# Altium schematic sheet FLYBACK.SchDoc
size A; SheetNumber: 2; SheetTotal: 21
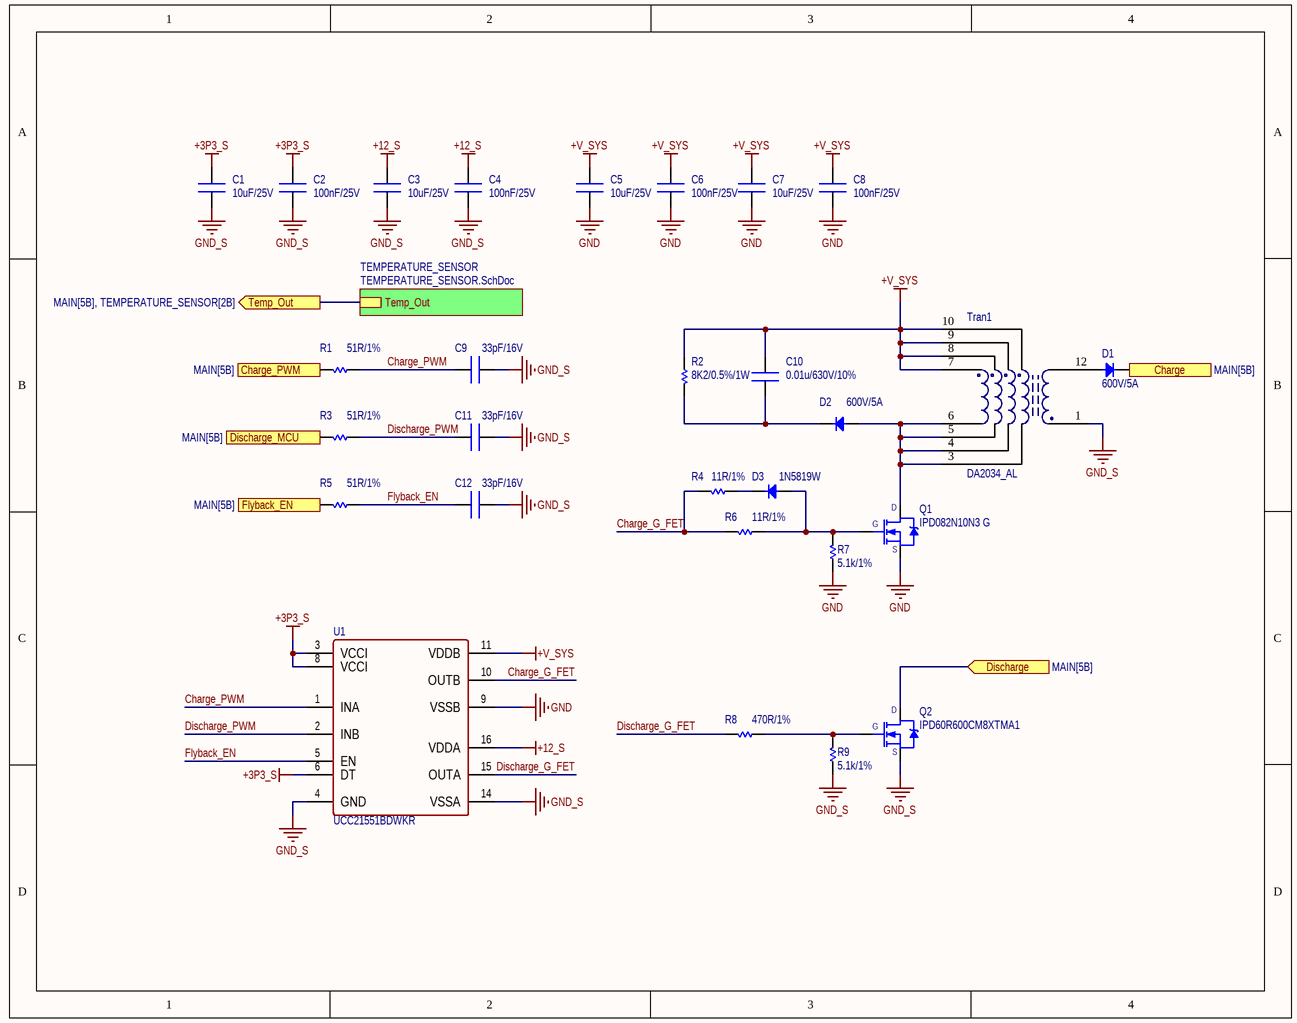
[diagram p0: FLYBACK.SchDoc]

## Parts
C1  10uF/25V  [CN-SMD-0603]
C2  100nF/25V  [CN-SMD-0603]
C3  10uF/25V  [CN-SMD-0603]
C4  100nF/25V  [CN-SMD-0603]
C5  10uF/25V  [CN-SMD-0603]
C6  100nF/25V  [CN-SMD-0603]
C7  10uF/25V  [CN-SMD-0603]
C8  100nF/25V  [CN-SMD-0603]
C9  33pF/16V  [CN-SMD-0603]
C10  0.01u/630V/10%  [CN-SMD-1206]
C11  33pF/16V  [CN-SMD-0603]
C12  33pF/16V  [CN-SMD-0603]
D1  600V/5A  [DIO-SMD-C]
D2  600V/5A  [DIO-SMD-C]
D3  1N5819W  [DIO-SMD-123]
Q1  IPD082N10N3 G  [TO252-123]
Q2  IPD60R600CM8XTMA1  [TO252-123]
R1  51R/1%  [RES-SMD-0603]
R2  8K2/0.5%/1W  [RES-SMD-1206]
R3  51R/1%  [RES-SMD-0603]
R4  11R/1%  [RES-SMD-1206]
R5  51R/1%  [RES-SMD-0603]
R6  11R/1%  [RES-SMD-1206]
R7  5.1k/1%  [RES-SMD-0603]
R8  470R/1%  [RES-SMD-0603]
R9  5.1k/1%  [RES-SMD-0603]
Tran1  DA2034_AL  [DA2034_AL]
U1  UCC21551BDWKR  [UCC21551BDWKR]

## Sub-sheets
TEMPERATURE_SENSOR = TEMPERATURE_SENSOR.SchDoc: Temp_Out

## Ports
Charge (out, see MAIN[5B]), Charge_PWM (in, see MAIN[5B]), Discharge (in, see MAIN[5B]), Discharge_MCU (in, see MAIN[5B]), Flyback_EN (in, see MAIN[5B]), Temp_Out (out, see MAIN[5B], TEMPERATURE_SENSOR[2B])

## Nets
+3P3_S: C1.2 C2.2 U1.3(VCCI) U1.6(DT) U1.8(VCCI)
+12_S: C3.2 C4.2 U1.16(VDDA)
+V_SYS: C5.2 C6.2 C7.2 C8.2 C10.2 R2.1 Tran1.7 Tran1.8 Tran1.9 Tran1.10 U1.11(VDDB)
GND: C5.1 C6.1 C7.1 C8.1 Q1.3(S) R7.1 U1.9(VSSB)
GND_S: C1.1 C2.1 C3.1 C4.1 C9.1 C11.1 C12.1 Q2.3(S) R9.1 Tran1.1 U1.4(GND) U1.14(VSSA)
Charge: D1.2(K) ; port Charge
Charge_G_FET: R4.2 R6.2 U1.10(OUTB)
Charge_PWM: C9.2 R1.1 U1.1(INA)
Charge_PWM: R1.2 ; port Charge_PWM  [a separate net that carries the same name]
Discharge: Q2.2(D) ; port Discharge
Discharge_G_FET: R8.2 U1.15(OUTA)
Discharge_MCU: R3.2 ; port Discharge_MCU
Discharge_PWM: C11.2 R3.1 U1.2(INB)
Flyback_EN: C12.2 R5.1 U1.5(EN)
Flyback_EN: R5.2 ; port Flyback_EN  [a separate net that carries the same name]
Temp_Out: port Temp_Out, sheet TEMPERATURE_SENSOR/Temp_Out
NetC10_1: C10.1 D2.2(K) R2.2
NetD1_1: D1.1(A) Tran1.12
NetD2_1: D2.1(A) Q1.2(D) Tran1.3 Tran1.4 Tran1.5 Tran1.6
NetD3_1: D3.1(A) Q1.1(G) R6.1 R7.2
NetD3_2: D3.2(K) R4.1
NetQ2_1: Q2.1(G) R8.1 R9.2

## Library data of the parts
C1 C3 C5 C7 = CN: 0603W106M250XD; PN: 0603W106M250XD
C2 C4 C6 C8 = CN: CL10B104KA8NNNC; PN: CL10B104KA8NNNC
C9 C11 C12 = CN: C0603C330K4RAC7867; PN: C0603C330K4RAC7867
C10 = CN: CL31B103KHFNFNE; Value: 33pF; PN: CL31B103KHFNFNE
D1 D2 = Diode SMD: VS-5ECU06-M3/9AT; Code - JEDEC: DO-214-AB; Published: 8-Jun-2000; Revision: July-2002: Re-released for DXP Platform.; Publisher: Altium Limited; PN: VS-5ECU06-M3/9AT
D3 = Diode SMD: Default Diode; Code - JEDEC: DO-214-AB; Published: 8-Jun-2000; Revision: July-2002: Re-released for DXP Platform.; Publisher: Altium Limited; PN: 1N5819W
Q1 Q2 = FDD8870
  Q1: PN: IPD082N10N3 G
  Q2: PN: IPD60R600CM8XTMA1
R1 R3 R5 = Res-SMD: ERJ-3EKF51R0V; Manufacturer: Generic Components; Class: Passive; PN: ERJ-3EKF51R0V; Publisher: Altium Hobart Technology Centre
R2 = Res-SMD: HRG3216P-8201-D-T1; Manufacturer: Generic Components; Class: Passive; PN: HRG3216P-8201-D-T1; Publisher: Altium Hobart Technology Centre
R4 R6 = Res-SMD: CRCW120611R0FKEAHP; Manufacturer: Generic Components; Class: Passive; PN: CRCW120611R0FKEAHP; Publisher: Altium Hobart Technology Centre
R7 R9 = Res-SMD: ERJ-3EKF5101V; PN: ERJ-3EKF5101V
R8 = Res-SMD: ERJ-1GJF4700C; Manufacturer: Generic Components; Class: Passive; PN: ERJ-1GJF4700C; Publisher: Altium Hobart Technology Centre
Tran1 = DA2034_AL: PN: DA2034_AL
U1 = UCC21551BDWKR: PN: UCC21551BDWKR